# EAGLE design PoERegulator35V (EAGLE 5.09)
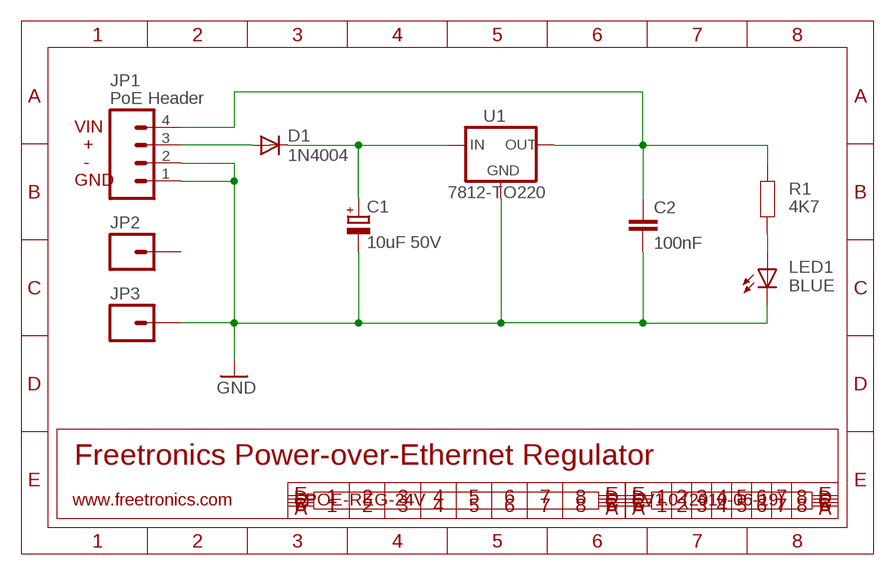
[diagram p0: schematic, sheet 1]

## Parts
C1  10uF 50V  CPOL-EUD  [PANASONIC_D]
C2  100nF  CAP0603  [0603]
D1  1N4004  DIODESMB  [SMB-DIODE]
JP1  PoE Header  M04PTH  [1X04]
JP2  M01PTH  [1X01]
JP3  M01PTH  [1X01]
LED1  BLUE  LED0603  [LED-0603]
R1  4K7  RESISTOR0603  [0603]
U1  7812-TO220  V_REG_78XXSIDE  [78XXL]

## Nets
GND: C1.- C2.2 JP1.1 JP1.2 JP3.1 LED1.C U1.GND
N$1: D1.A JP1.3
N$131: LED1.A R1.2
POE+: C1.+ D1.C U1.IN
VIN: C2.1 JP1.4 R1.1 U1.OUT
Unconnected: JP2.1

## Notes on the sheet
- VIN
- +
- -
- GND
- Freetronics Power-over-Ethernet Regulator
- www.freetronics.com | POE-REG-24V | V1.0 (2010-06-19)

## Library data of the parts
C1 = rcl:CPOL-EU: POLARIZED CAPACITOR, European symbol
C2 = freetronics:CAP: Capacitor Standard 0603 ceramic capacitor, and 0.1" leaded capacitor.
D1 = freetronics:DIODE: Diode These are standard reverse protection diodes and small signal diodes. SMA package can handle up to about 1A. SOD-323 can handle about 200mA. What the SOD-323 package when ordering, there are some mfgs out there that are 5-pin packages.
JP1 = freetronics:M04: Header 4 Standard 4-pin 0.1" header. Use with straight break away headers (SKU : PRT-00116), right angle break away headers (PRT-00553), swiss pins (PRT-00743), machine pins (PRT-00117), and female headers (PRT-00115). Molex polarized connector foot print use with SKU : PRT-08231 with associated crimp pins and housings.
JP2 JP3 = freetronics:M01: Header 1 Standard 1-pin 0.1" header. Use with straight break away headers (SKU : PRT-00116), right angle break away headers (PRT-00553), swiss pins (PRT-00743), machine pins (PRT-00117), and female headers (PRT-00115).
LED1 = freetronics:LED: LEDs Standard schematic elements and footprints for 5mm, 3mm, 1206, and 0603 sized LEDs. 5mm - Spark Fun Electronics SKU : COM-00529 (and others)
R1 = freetronics:RESISTOR: Resistor Basic schematic elements and footprints for 0603, 1206, and PTH 1/10th watt (small) resistors.
U1 = freetronics-2:V_REG_78XX: Voltage Regulator Standard 7805 5V regulator. IGO (Input Ground Output). Spark Fun Electronics SKU : COM-00107

## Board
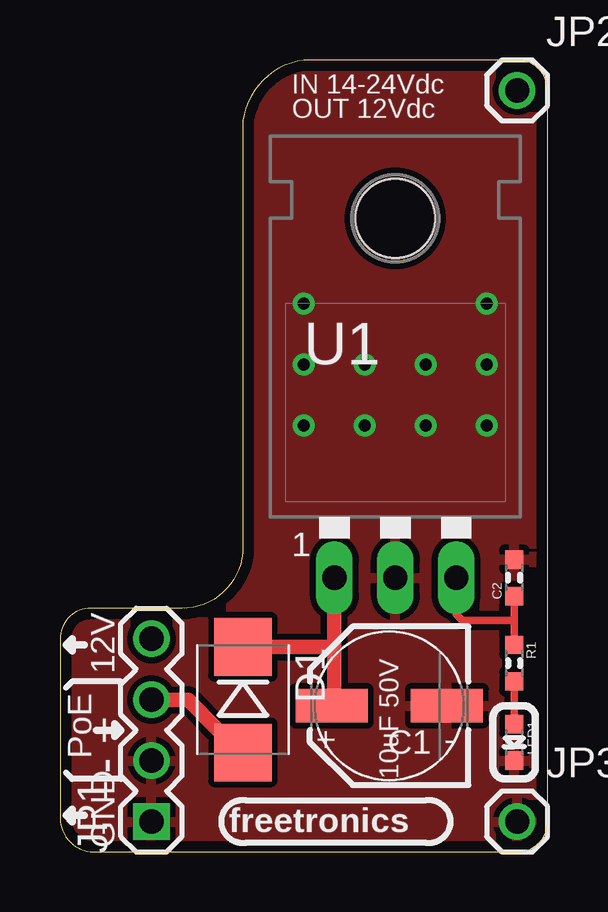
[diagram p1: board, top side]
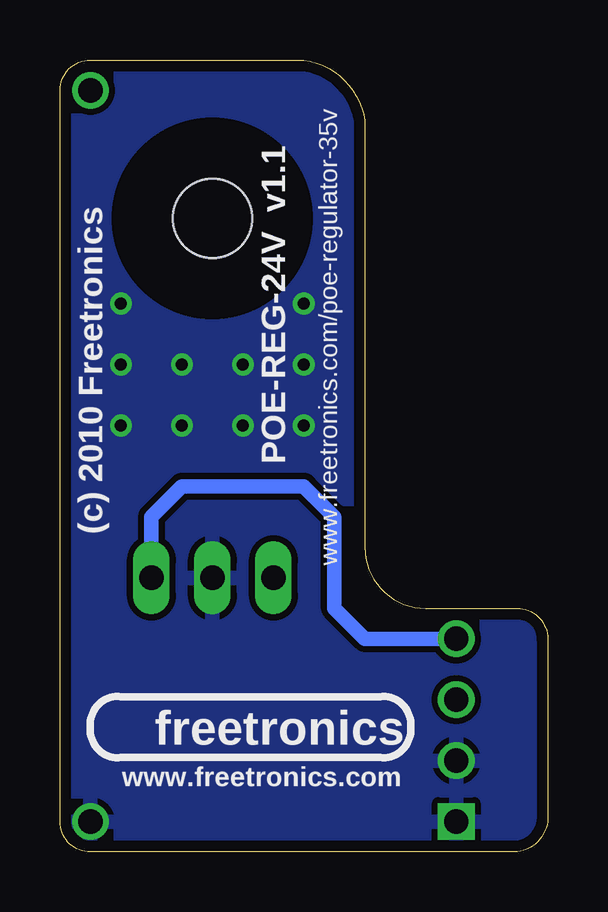
[diagram p2: board, bottom side, seen from below]

Size 20.32 x 33.02 mm. Coordinates in mm from the lower left corner, seen from the top.
Outline: 0,1.27 arc74 1.27,0 19.05,0 arc90 20.32,1.27 20.32,31.75 arc90 19.05,33.02 10.16,33.02 arc74 7.62,30.48 7.62,12.7 arc-90 5.08,10.16 1.27,10.16 arc90 0,8.89 0,1.27
Copper layers (1*16): Top 0.035mm / dielectric 1.5mm / Bottom 0.035mm
Design rules "default *": minimum track width 10mil, minimum drill 18mil, track to track 10mil, track to pad 10mil, pad to pad 10mil, via to via 10mil, smd to smd 8mil, copper to edge 18mil, drill to drill 8mil, minimum pad ring 10mil, minimum via ring 8mil, stop-mask expansion 4mil, vias tented up to drill 25mil, thermal gap 10mil

### Footprints (pad centres in the part's own frame; a part is rotated, then mirrored left to right if it is on the bottom)
PANASONIC_D = smd 3 x 1.4: + 2.4,0; - -2.4,0
0603 = smd 0.762 x 0.762: 1 -0.762,0; 2 0.762,0
SMB-DIODE = smd 2.4 x 2.4: A 2.2,0; C -2.2,0
1X04 = drill 1.016 square: 1 0,0 | drill 1.016 round: 2 2.54,0; 3 5.08,0; 4 7.62,0
1X01 = drill 1.016 round: 1 0,0
LED-0603 = smd 0.762 x 0.762: A -0.762,0; C 0.762,0
78XXL = drill 1.016 long: GND 0,-3.81; IN -2.54,-3.81; OUT 2.54,-3.81 | hole 3.302: 0,11.176

### Placement (x,y rotation side)
C1  13.72,6.1 180 top
C2  18.92,11.43 90 top
D1  7.62,6.35 270 top
JP1  3.81,1.27 90 top
JP2  19.05,31.75 0 top
JP3  19.05,1.27 0 top
LED1  18.92,4.57 270 top
R1  18.92,7.87 270 top
U1  13.97,15.24 0 top

### Tracks (layer width: path | path; a pad name or v marks a point on that pad's centre or on a via)
GND  (via drill 0.5)
  other vias: 10.16,17.78 10.16,22.86 10.16,20.32 17.78,20.32 12.7,20.32 17.78,22.86 15.24,20.32 12.7,17.78 15.24,17.78 17.78,17.78
  pour Top: 1.27,0 arc-90 0,1.27 0,8.89 arc-90 1.27,10.16 5.08,10.16 arc90 7.62,12.7 7.62,30.48 arc-90 10.16,33.02 19.05,33.02 arc-90 20.32,31.75 20.32,1.27 arc-90 19.05,0
  pour Bottom: 0,1.27 0,8.89 arc-90 1.27,10.16 5.08,10.16 arc90 7.62,12.7 7.62,30.48 arc-90 10.16,33.02 19.05,33.02 arc-90 20.32,31.75 20.32,1.27 arc-90 19.05,0 1.27,0 arc-90
N$1
  Top 0.61: JP1.3 5.33,6.35 6.6,5.08 D1.A
N$131
  Top 0.305: LED1.A R1.2
POE+
  Top 0.61: 11.43,8.55 U1.IN | D1.C 11.43,8.55 | 11.43,8.55 11.43,6.86 C1.+
VIN
  Top 0.305: U1.OUT 16.51,9.91 16.76,9.65 18.92,9.65 | 18.92,9.65 R1.1 | 18.92,9.65 C2.1
  Bottom 0.61: JP1.4 7.62,8.89 8.89,10.16 8.89,13.97 10.16,15.24 15.24,15.24 16.51,13.97 U1.OUT

### Text on the board
tPlace: IN 14-24Vdc | OUT 12Vdc | 1 | 12V | PoE | + | - | - + | 10uF 50V | freetronics | GND
bPlace: www.freetronics.com/poe-regulator-35v | POE-REG-24V v1.1 | (c) 2010 Freetronics | freetronics | www.freetronics.com